# EAGLE design pc-register (EAGLE 9.6.2)
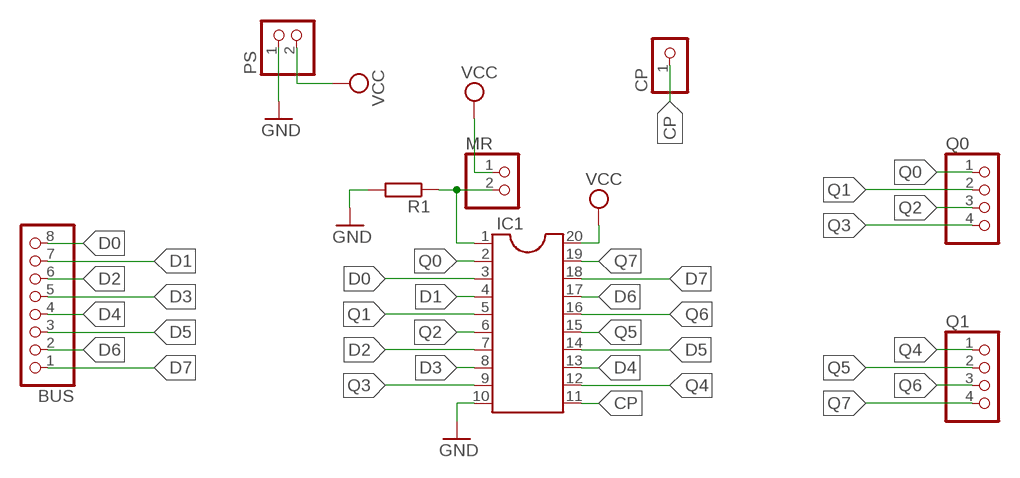
[diagram p0: schematic, sheet 1]

## Parts
BUS  PINHD-1X8  [1X08]
CP  PINHD-1X1  [1X01]
IC1  DIL20S  [SOCKET-20]
MR  PINHD-1X2  [1X02]
PS  PINHD-1X2  [1X02]
Q0  PINHD-1X4  [1X04]
Q1  PINHD-1X4  [1X04]
R1  R-EU_0204/7  [0204/7]

## Nets
CLR: IC1.1 MR.2 R1.1
CP: CP.1 IC1.11
D0: BUS.8 IC1.3
D1: BUS.7 IC1.4
D2: BUS.6 IC1.7
D3: BUS.5 IC1.8
D4: BUS.4 IC1.13
D5: BUS.3 IC1.14
D6: BUS.2 IC1.17
D7: BUS.1 IC1.18
GND: IC1.10 PS.1 R1.2
Q0: IC1.2 Q0.1
Q1: IC1.5 Q0.2
Q2: IC1.6 Q0.3
Q3: IC1.9 Q0.4
Q4: IC1.12 Q1.1
Q5: IC1.15 Q1.2
Q6: IC1.16 Q1.3
Q7: IC1.19 Q1.4
VCC: IC1.20 MR.1 PS.2

## Library data of the parts
BUS = pinhead:PINHD-1X8: PIN HEADER
CP = pinhead:PINHD-1X1: PIN HEADER
IC1 = ic-package:DIL20: Dual In Line / Socket
MR PS = pinhead:PINHD-1X2: PIN HEADER
Q0 Q1 = pinhead:PINHD-1X4: PIN HEADER
R1 = rcl:R-EU_: RESISTOR, European symbol; SPICEPREFIX: R

## Board
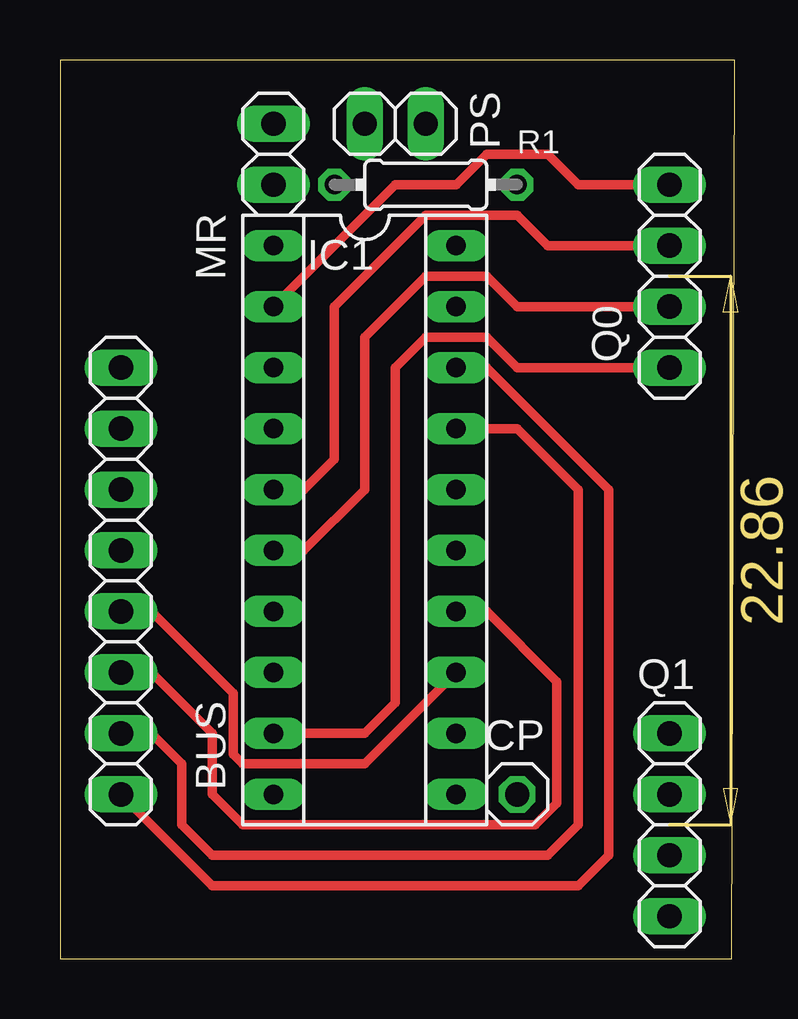
[diagram p1: board, top side]
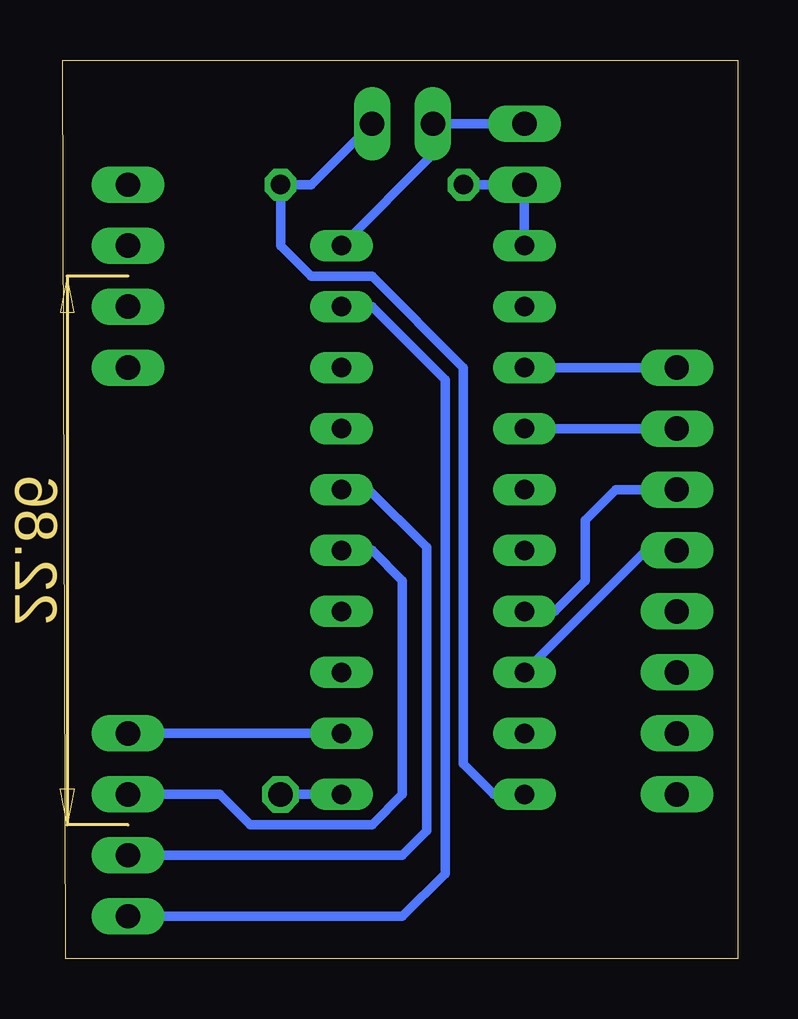
[diagram p2: board, bottom side, seen from below]

Size 28.12 x 37.45 mm. Coordinates in mm from the lower left corner, seen from the top.
Outline: 0,0 27.99,0 28.12,37.45 0,37.45 0,0
Copper layers (1*16): Top 0.035mm / dielectric 1.5mm / Bottom 0.035mm
Design rules "default": minimum track width 6mil, minimum drill 0.35mm, track to track 6mil, track to pad 6mil, pad to pad 6mil, via to via 6mil, smd to smd 6mil, copper to edge 40mil, drill to drill 6mil, minimum pad ring 10mil, minimum via ring 8mil, stop-mask expansion 4mil, vias tented up to drill 0mil, thermal gap 10mil

### Footprints (pad centres in the part's own frame; a part is rotated, then mirrored left to right if it is on the bottom)
1X08 = drill 1.016 long: 1 -8.89,0; 2 -6.35,0; 3 -3.81,0; 4 -1.27,0; 5 1.27,0; 6 3.81,0; 7 6.35,0; 8 8.89,0
1X01 = drill 1.016 octagon: 1 0,0
SOCKET-20 = drill 0.813 long: 1 -11.43,-3.81; 2 -8.89,-3.81; 3 -6.35,-3.81; 4 -3.81,-3.81; 5 -1.27,-3.81; 6 1.27,-3.81; 7 3.81,-3.81; 8 6.35,-3.81; 9 8.89,-3.81; 10 11.43,-3.81; 11 11.43,3.81; 12 8.89,3.81; 13 6.35,3.81; 14 3.81,3.81; 15 1.27,3.81; 16 -1.27,3.81; 17 -3.81,3.81; 18 -6.35,3.81; 19 -8.89,3.81; 20 -11.43,3.81
1X02 = drill 1.016 long: 1 -1.27,0; 2 1.27,0
1X04 = drill 1.016 long: 1 -3.81,0; 2 -1.27,0; 3 1.27,0; 4 3.81,0
0204/7 = drill 0.813 octagon: 1 -3.81,0; 2 3.81,0

### Placement (x,y rotation side)
BUS  2.54,15.75 90 top
CP  19.05,6.86 0 top
IC1  12.7,18.29 270 top
MR  8.89,33.53 270 top
PS  13.97,34.8 180 top
Q0  25.4,28.45 270 top
Q1  25.4,5.59 270 top
R1  15.24,32.26 0 top

### Tracks (layer width: path | path; a pad name or v marks a point on that pad's centre or on a via)
CLR
  Bottom 0.4: IC1.1 MR.2 R1.1
CP
  Bottom 0.4: IC1.11 CP.1
D0
  Bottom 0.4: IC1.3 BUS.8
D1
  Bottom 0.4: BUS.7 IC1.4
D2
  Bottom 0.4: BUS.6 5.08,19.56 6.35,18.29 6.35,15.75 7.62,14.48 IC1.7
D3
  Bottom 0.4: BUS.5 3.81,17.02 IC1.8
D4
  Top 0.4: BUS.4 3.81,14.48 7.22,11.07 7.22,8.53 7.62,8.13 12.7,8.13 IC1.13
D5
  Top 0.4: BUS.3 3.81,11.94 6.35,9.4 6.35,6.86 7.62,5.59 19.81,5.59 20.7,6.48 20.7,11.56 17.78,14.48 IC1.14
D6
  Top 0.4: IC1.17 19.05,22.1 21.59,19.56 21.59,5.59 20.32,4.32 6.35,4.32 5.08,5.59 5.08,8.13 3.81,9.4 BUS.2
D7
  Top 0.4: BUS.1 6.35,3.05 21.59,3.05 22.86,4.32 22.86,19.56 17.78,24.64 IC1.18
GND
  Bottom 0.4: PS.1 17.78,32.26 R1.2 19.05,29.72 17.78,28.45 15.24,28.45 11.43,24.64 11.43,8.13 10.16,6.86 IC1.10
Q0
  Top 0.4: IC1.2 13.97,32.26 16.51,32.26 17.78,33.53 20.32,33.53 21.59,32.26 Q0.1
Q1
  Top 0.4: IC1.5 10.16,19.56 11.43,20.83 11.43,27.18 15.24,30.99 19.05,30.99 20.32,29.72 Q0.2
Q2
  Top 0.4: IC1.6 10.16,17.02 12.7,19.56 12.7,25.91 15.24,28.45 17.78,28.45 19.05,27.18 Q0.3
Q3
  Top 0.4: Q0.4 19.05,24.64 17.78,25.91 15.24,25.91 13.97,24.64 13.97,10.67 12.7,9.4 IC1.9
Q4
  Bottom 0.4: Q1.1 IC1.12
Q5
  Bottom 0.4: IC1.15 15.24,17.02 13.97,15.75 13.97,6.86 15.24,5.59 20.32,5.59 21.59,6.86 Q1.2
Q6
  Bottom 0.4: Q1.3 13.97,4.32 12.95,5.33 12.95,17.14 15.37,19.56 IC1.16
Q7
  Bottom 0.4: Q1.4 13.97,1.78 12.19,3.56 12.19,24.13 15.24,27.18 IC1.19
VCC
  Bottom 0.4: MR.1 PS.2 12.7,33.53 IC1.20